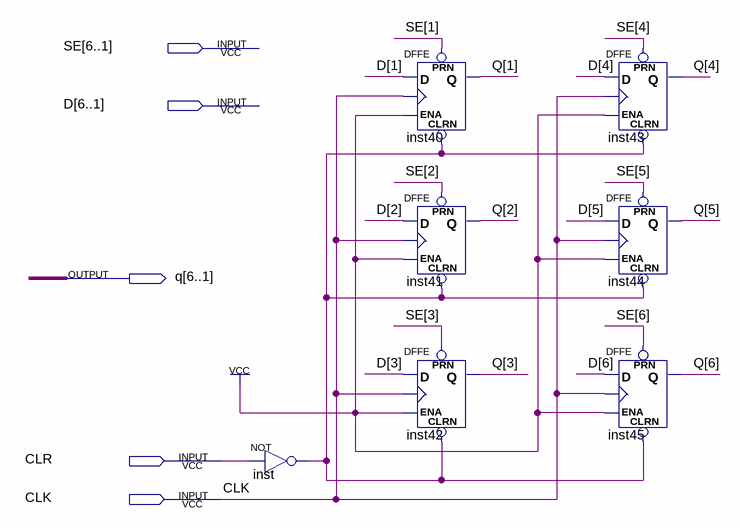
[diagram p0: schematic sheet]
// Quartus schematic uARReg.bdf as structural Verilog: 7 symbols, 5 pins
module uARReg (
  input  [6:1] SE,
  input  [6:1] D,
  input  CLR,
  input  CLK,
  output [6:1] q
);

  wire inst_out;

  not inst (inst_out, CLR);
  DFFE inst40 (.PRN(SE[1]), .CLRN(inst_out), .D(D[1]), .CLK(CLK), .ENA(1'b1), .Q(q[1]));
  DFFE inst41 (.PRN(SE[2]), .CLRN(inst_out), .D(D[2]), .CLK(CLK), .ENA(1'b1), .Q(q[2]));
  DFFE inst42 (.PRN(SE[3]), .CLRN(inst_out), .D(D[3]), .CLK(CLK), .ENA(1'b1), .Q(q[3]));
  DFFE inst43 (.PRN(SE[4]), .CLRN(inst_out), .D(D[4]), .CLK(CLK), .ENA(1'b1), .Q(q[4]));
  DFFE inst44 (.PRN(SE[5]), .CLRN(inst_out), .D(D[5]), .CLK(CLK), .ENA(1'b1), .Q(q[5]));
  DFFE inst45 (.PRN(SE[6]), .CLRN(inst_out), .D(D[6]), .CLK(CLK), .ENA(1'b1), .Q(q[6]));
endmodule
